# Altium schematic sheet 5V_Power_Supply.SchDoc: STM32F446 CNC
size B; Author: AM; CompanyName: Expatria Technologies; DrawnBy: A.Marles; Engineer: AM; Organization: Expatria Technolgoies; DocumentNumber: 9; SheetNumber: 8; SheetTotal: 7
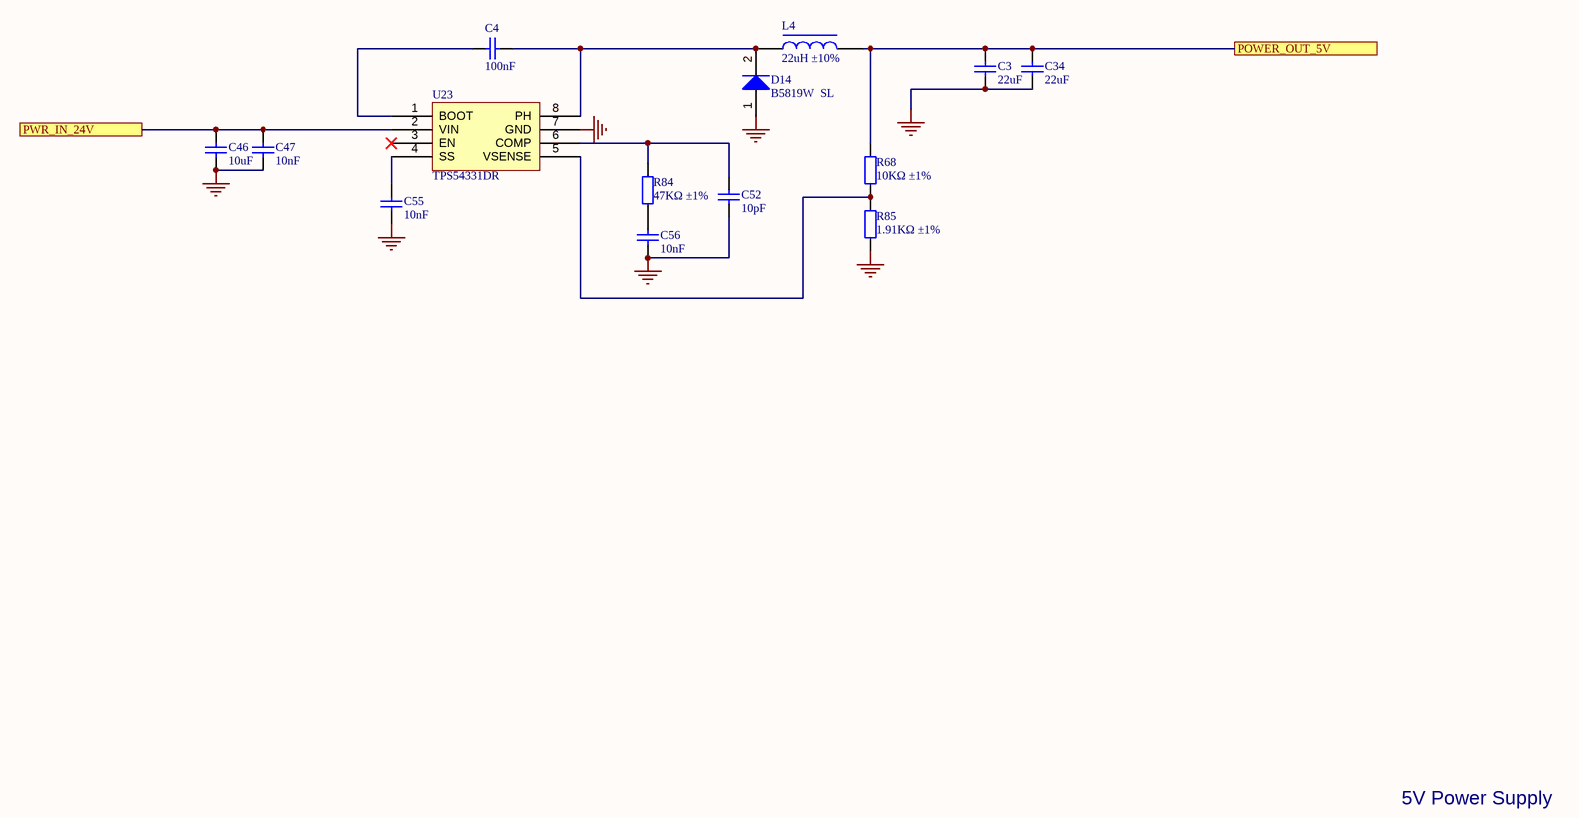
[diagram p0: 5V_Power_Supply.SchDoc]

## Parts
C3  22uF  [0805_C]
C4  100nF  [0402_C]
C34  22uF  [0805_C]
C46  10uF  [1206_C]
C47  10nF  [0402_C]
C52  10pF  [0402_C]
C55  10nF  [0402_C]
C56  10nF  [0402_C]
D14  B5819W  SL  [SOD-123]
L4  22uH ±10%  [INDP4040X30N]
R68  10KΩ ±1%  [0603_R]
R84  47KΩ ±1%  [0402_R]
R85  1.91KΩ ±1%  [0603_R]
U23  TPS54331DR  [SOIC-8_150mil]

## Ports
POWER_OUT_5V, PWR_IN_24V

## Nets
GND: C3.1 C34.1 C46.1 C47.1 C52.1 C55.1 C56.1 D14.1(A) R85.1 U23.7(GND)
POWER_OUT_5V: C3.2 C34.2 L4.2 R68.2 ; port POWER_OUT_5V
PWR_IN_24V: C46.2 C47.2 U23.2(VIN) ; port PWR_IN_24V
NetC4_1: C4.1 U23.1(BOOT)
NetC4_2: C4.2 D14.2(K) L4.1 U23.8(PH)
NetC52_2: C52.2 R84.2 U23.6(COMP)
NetC55_2: C55.2 U23.4(SS)
NetC56_2: C56.2 R84.1
NetR68_1: R68.1 R85.2 U23.5(VSENSE)

Not connected (* = marked no-connect by the designer): U23 3(EN)*

## Notes on the sheet
- 5V Power Supply
- SHEET
- Expatria Technologies
- 1136 Glade Court
- Port Coquitlam, BC V3B 1R5
- PROJECT
- SIZE
- ENGR
- MODIFIED
- DOCUMENT
- REV
- Copyright Expatria Technologies 2023. This document describes Open Hardware and is licensed under the CERN-OHL-S v2. No warranty is implied or expressed.
- EMAIL: INFO@EXPATRIA.CA
- B
- /

## Library data of the parts
C3 C34 = 0805 22uF (226) 20% 25V: Chip capacitors; Manufacturer: Samsung Electro-Mechanics; PartNumber: CL21A226MAQNNNE; Tolerance: 20%; Voltage: 25V; Package: 0805; Supplier: LC; SuppliersPartNumber: C2922481; Capacitance: 22uF; ComponentLink1Description: Supplier link; ComponentLink1URL: http://www.szlcsc.com/product/details_46786.html
C4 = 0402 100nF (104) 10% 16V: Chip capacitors; Manufacturer: Samsung Electro-Mechanics; PartNumber: CL05B104KO5NNNC; Tolerance: 10%; Voltage: 16V; Package: 0402; Supplier: LC; SuppliersPartNumber: C1525; Capacitance: 100nF; ComponentLink1Description: Supplier link; ComponentLink1URL: http://www.szlcsc.com/product/details_1877.html
C46 = 1206 10uF (106) 10% 50V: Chip capacitors; Manufacturer: Samsung Electro-Mechanics; PartNumber: CL31A106KBHNNNE; Tolerance: 10%; Voltage: 50V; Package: 1206; Supplier: LC; SuppliersPartNumber: C13585; Capacitance: 10uF; Manufacturer 1: Samsung Electro-Mechanics
C47 C55 C56 = 0402 10nF (103) 10% 50V: Chip capacitors; Manufacturer: Samsung Electro-Mechanics; PartNumber: CL05B103KB5NNNC; Tolerance: 10%; Voltage: 50V; Package: 0402; Supplier: LC; SuppliersPartNumber: C15195; Capacitance: 10nF; ComponentLink1Description: Supplier link; ComponentLink1URL: http://www.szlcsc.com/product/details_15869.html
C52 = 0402 10pF (100) 5% 50V: Chip capacitors; Manufacturer: Samsung Electro-Mechanics; PartNumber: CL05C100JB5NNNC; Tolerance: 5%; Voltage: 50V; Package: 0402; Supplier: LC; SuppliersPartNumber: C32949; Capacitance: 10pF; ComponentLink1Description: Supplier link; ComponentLink1URL: http://www.szlcsc.com/product/details_33914.html
D14 = SOD-123 B5819W  SL: Schottky Diode; ComponentLink1Description: 供应商链接; ComponentLink1URL: http://www.szlcsc.com/product/details_9093.html; Package: SOD-123; Supplier: LC; SuppliersPartNumber: C8598
L4 = 4x4x3 22uH 20%: 1A 22uH ±20% SMD,4x4x3mm Power Inductors ROHS; Package: SMD,4x4x3mm; Supplier: LC; SuppliersPartNumber: C167883
R68 = 0603 10K (1002) 1%: Chip resistor; Manufacturer: Uniroyal Elec; PartNumber: 0603WAF1002T5E; Power: 1/10W; Package: 0603; Supplier: LC; SuppliersPartNumber: C25804; Resistance: 10KΩ; Tolerance: 1%; ComponentLink1Description: Supplier link; ComponentLink1URL: http://www.szlcsc.com/product/details_26547.html
R84 = 0402 47K (4702) 1%: Chip resistor; Manufacturer: Uniroyal Elec; PartNumber: 0402WGF4702TCE; Power: 1/16W; Package: 0402; Supplier: LC; SuppliersPartNumber: C25792; Resistance: 47KΩ; Tolerance: 1%; ComponentLink1Description: Supplier link; ComponentLink1URL: http://www.szlcsc.com/product/details_26535.html
R85 = 0603 2K (2001) 1%: Chip resistor; Manufacturer: Uniroyal Elec; PartNumber: 0603WAF1911T5E; Power: 1/10W; Package: 0603; Supplier: LC; SuppliersPartNumber: C22853; Resistance: 1.91KΩ; Tolerance: 1%; ComponentLink1Description: Supplier link; ComponentLink1URL: http://www.szlcsc.com/product/details_23702.html
U23 = TPS54331DR_[C9865]: Switching Voltage Regulators 3A 28V In Step Down SWIFT DC/DC Cnvrtr; Package: SOIC-8_150mil; Supplier: LC; SuppliersPartNumber: C9865